# EAGLE schematic clock-generator (EAGLE 7.7.0)
REVISION: v2

## Sheet 1 of 2
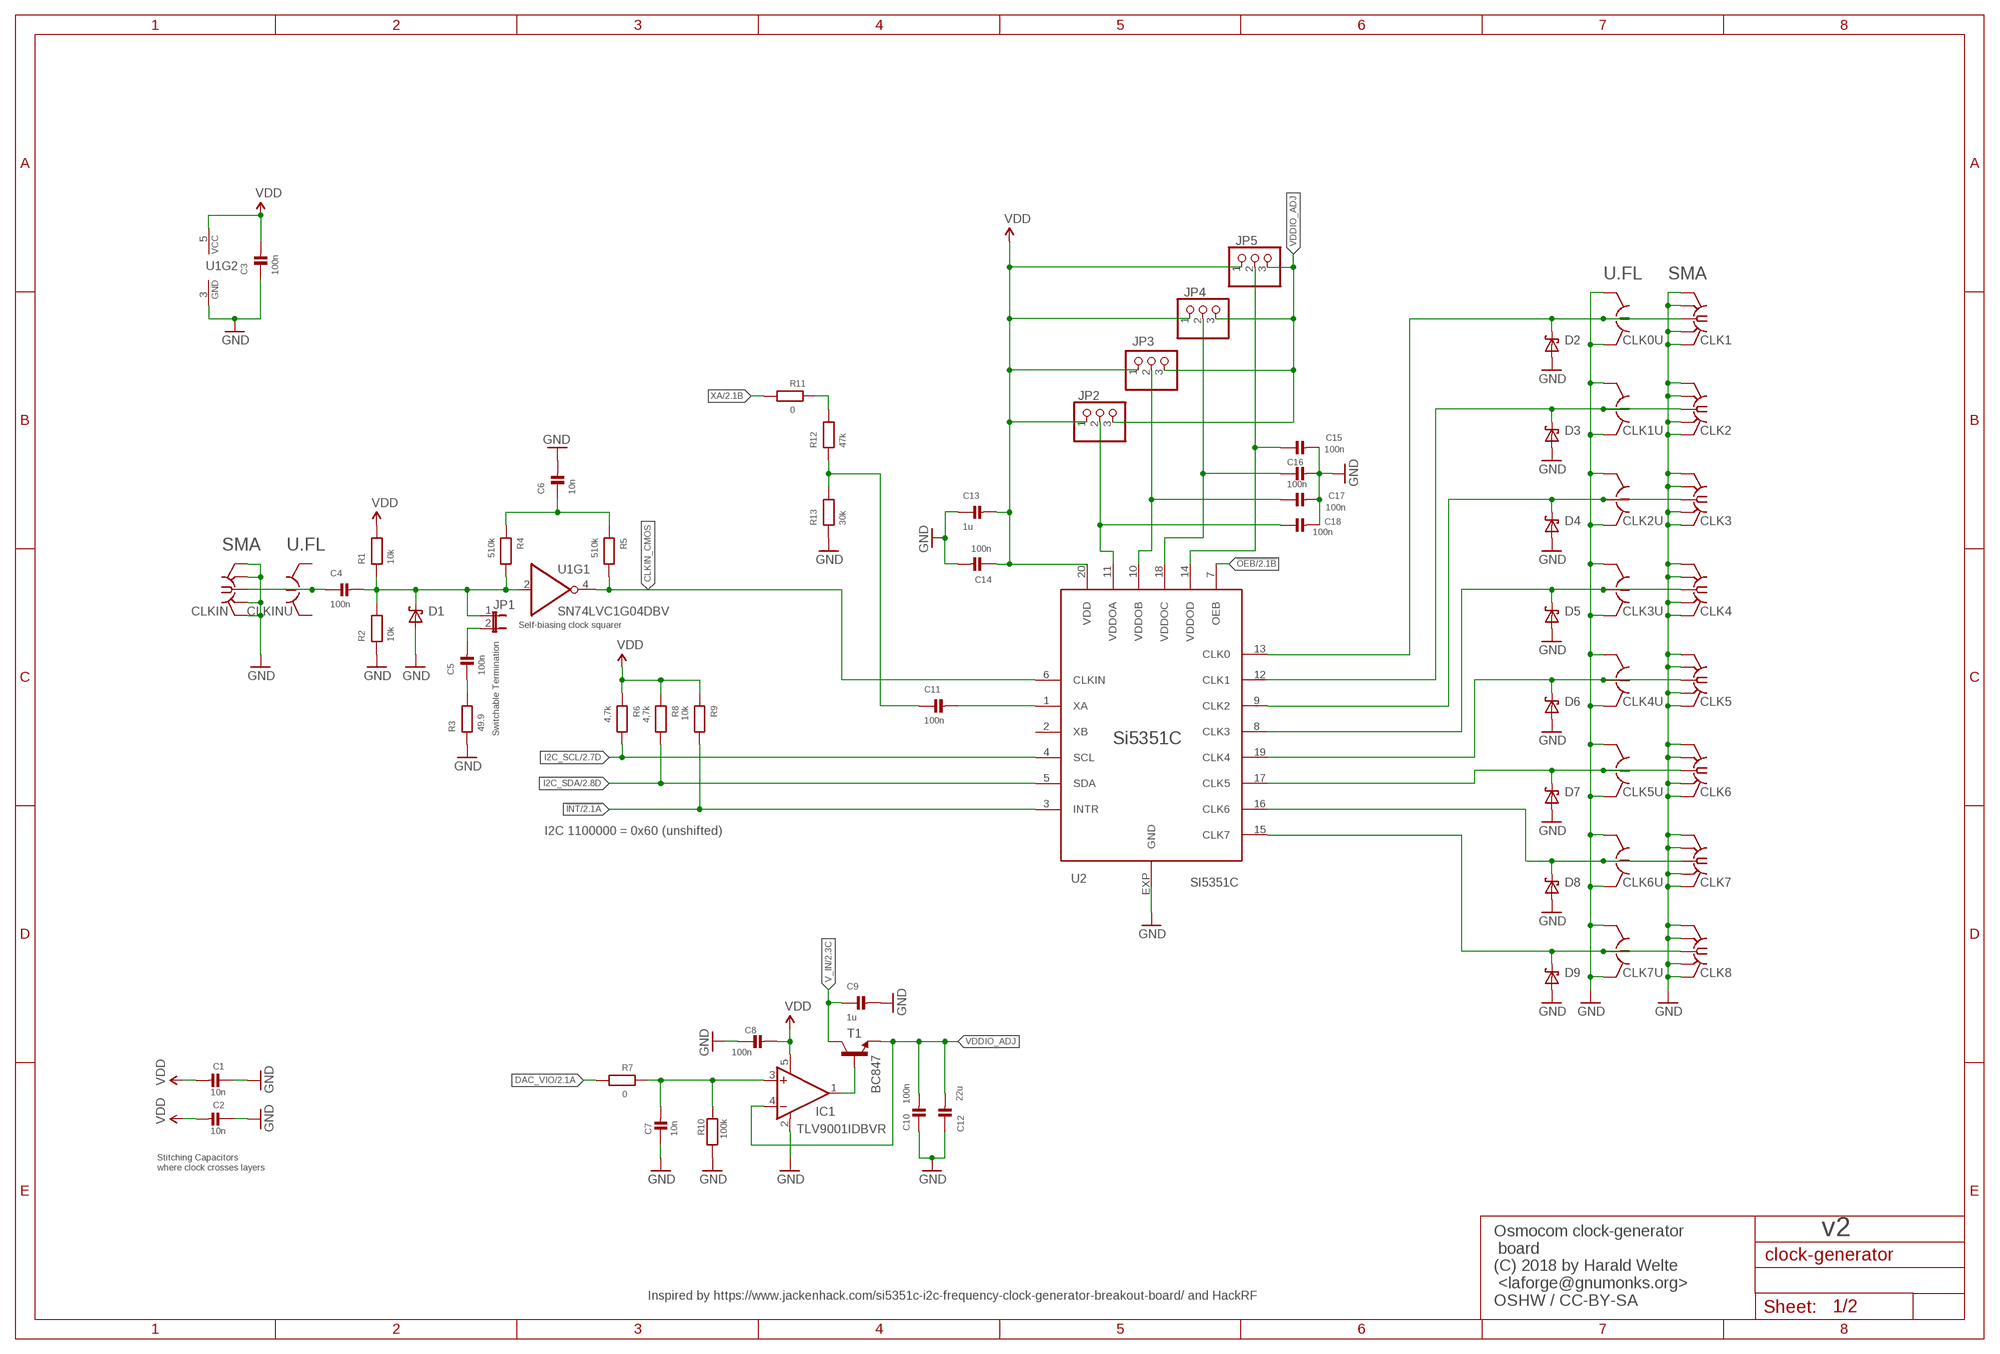
[diagram p0: schematic, sheet 1]

### Parts
C1  10n  CAP_CERAMIC_0402  [_0402]
C2  10n  CAP_CERAMIC_0402  [_0402]
C3  100n  CAP_CERAMIC_0603  [_0603]
C4  100n  CAP_CERAMIC_0603  [_0603]
C5  100n  CAP_CERAMIC_0603  [_0603]
C6  10n  CAP_CERAMIC_0402  [_0402]
C7  10n  CAP_CERAMIC_0402  [_0402]
C8  100n  CAP_CERAMIC_0402  [_0402]
C9  1u  CAP_CERAMIC_0603  [_0603]
C10  100n  CAP_CERAMIC_0402  [_0402]
C11  100n  CAP_CERAMIC_0603  [_0603]
C12  22u  CAP_CERAMIC_0805  [_0805]
C13  1u  CAP_CERAMIC_0603  [_0603]
C14  100n  CAP_CERAMIC_0603  [_0603]
C15  100n  CAP_CERAMIC_0402  [_0402]
C16  100n  CAP_CERAMIC_0402  [_0402]
C17  100n  CAP_CERAMIC_0402  [_0402]
C18  100n  CAP_CERAMIC_0402  [_0402]
CLK0U  HRS_UFL  [HRS_UFL]
CLK1  SMA-F-S-TH  [SMA-F-S-TH]
CLK1U  HRS_UFL  [HRS_UFL]
CLK2  SMA-F-S-TH  [SMA-F-S-TH]
CLK2U  HRS_UFL  [HRS_UFL]
CLK3  SMA-F-S-TH  [SMA-F-S-TH]
CLK3U  HRS_UFL  [HRS_UFL]
CLK4  SMA-F-S-TH  [SMA-F-S-TH]
CLK4U  HRS_UFL  [HRS_UFL]
CLK5  SMA-F-S-TH  [SMA-F-S-TH]
CLK5U  HRS_UFL  [HRS_UFL]
CLK6  SMA-F-S-TH  [SMA-F-S-TH]
CLK6U  HRS_UFL  [HRS_UFL]
CLK7  SMA-F-S-TH  [SMA-F-S-TH]
CLK7U  HRS_UFL  [HRS_UFL]
CLK8  SMA-F-S-TH  [SMA-F-S-TH]
CLKIN  SMA-F-S-TH  [SMA-F-S-TH]
CLKINU  HRS_UFL  [HRS_UFL]
D1  0603ESDA-TR  [0603]
D2  0603ESDA-TR  [0603]
D3  0603ESDA-TR  [0603]
D4  0603ESDA-TR  [0603]
D5  0603ESDA-TR  [0603]
D6  0603ESDA-TR  [0603]
D7  0603ESDA-TR  [0603]
D8  0603ESDA-TR  [0603]
D9  0603ESDA-TR  [0603]
IC1  TLV9001IDBVR  OPA237N  [SOT23-5]
JP1  JP1E  [JP1]
JP2  PINHD-1X03_2.54-S  [1X03-S]
JP3  PINHD-1X03_2.54-S  [1X03-S]
JP4  PINHD-1X03_2.54-S  [1X03-S]
JP5  PINHD-1X03_2.54-S  [1X03-S]
R1  10k  RESISTOR_0603  [_0603]
R2  10k  RESISTOR_0603  [_0603]
R3  49.9  RESISTOR_0603  [_0603]
R4  510k  RESISTOR_0603  [_0603]
R5  510k  RESISTOR_0603  [_0603]
R6  4,7k  RESISTOR_0603  [_0603]
R7  0  RESISTOR_0603  [_0603]
R8  4,7k  RESISTOR_0603  [_0603]
R9  10k  RESISTOR_0603  [_0603]
R10  100k  RESISTOR_0603  [_0603]
R11  0  RESISTOR_0603  [_0603]
R12  47k  RESISTOR_0603  [_0603]
R13  30k  RESISTOR_0603  [_0603]
T1  BC847  BC847C-NPN-SOT23-BEC  [SOT23-BEC]
U1  SN74LVC1G04DBV  [DBV0005A]
U2  SI5351C  [QFN-20]

### Nets
!INT: R9.2 U2.3(INTR) ; also sheet 2
!OEB [supply]: U2.7(OEB) ; also sheet 2
CLK0_LINE [clocklines]: CLK0U.SIG CLK1.C D2.2(K) U2.13(CLK0)
CLK1_LINE [clocklines]: CLK1U.SIG CLK2.C D3.2(K) U2.12(CLK1)
CLK2_LINE [clocklines]: CLK2U.SIG CLK3.C D4.2(K) U2.9(CLK2)
CLK3_LINE [clocklines]: CLK3U.SIG CLK4.C D5.2(K) U2.8(CLK3)
CLK4_LINE [clocklines]: CLK4U.SIG CLK5.C D6.2(K) U2.19(CLK4)
CLK5_LINE [clocklines]: CLK5U.SIG CLK6.C D7.2(K) U2.17(CLK5)
CLK6_LINE [clocklines]: CLK6U.SIG CLK7.C D8.2(K) U2.16(CLK6)
CLK7_LINE [clocklines]: CLK7U.SIG CLK8.C D9.2(K) U2.15(CLK7)
CLKIN [clocklines]: C4.1 CLKIN.C CLKINU.SIG
CLKIN_AC [clocklines]: C4.2 D1.2(K) JP1.1 R1.1 R2.2 R4.2 U1.2(I)
CLKIN_CMOS [clocklines]: R5.2 U1.4(O) U2.6(CLKIN)
DAC_VIO: R7.2 ; also sheet 2
GND [gnd-poly]: C1.1 C2.1 C3.1 C6.2 C7.1 C8.1 C9.2 C10.1 C12.1 C13.1 C14.2 C15.2 C16.2 C17.2 C18.2 CLK0U.GND@1(GND) CLK0U.GND@2(GND) CLK1.G1(GND) CLK1.G2(GND) CLK1.G3(GND) CLK1.G4(GND) CLK1U.GND@1(GND) CLK1U.GND@2(GND) CLK2.G1(GND) CLK2.G2(GND) CLK2.G3(GND) CLK2.G4(GND) CLK2U.GND@1(GND) CLK2U.GND@2(GND) CLK3.G1(GND) CLK3.G2(GND) CLK3.G3(GND) CLK3.G4(GND) CLK3U.GND@1(GND) CLK3U.GND@2(GND) CLK4.G1(GND) CLK4.G2(GND) CLK4.G3(GND) CLK4.G4(GND) CLK4U.GND@1(GND) CLK4U.GND@2(GND) CLK5.G1(GND) CLK5.G2(GND) CLK5.G3(GND) CLK5.G4(GND) CLK5U.GND@1(GND) CLK5U.GND@2(GND) CLK6.G1(GND) CLK6.G2(GND) CLK6.G3(GND) CLK6.G4(GND) CLK6U.GND@1(GND) CLK6U.GND@2(GND) CLK7.G1(GND) CLK7.G2(GND) CLK7.G3(GND) CLK7.G4(GND) CLK7U.GND@1(GND) CLK7U.GND@2(GND) CLK8.G1(GND) CLK8.G2(GND) CLK8.G3(GND) CLK8.G4(GND) CLKIN.G1(GND) CLKIN.G2(GND) CLKIN.G3(GND) CLKIN.G4(GND) D1.1(A) D2.1(A) D3.1(A) D4.1(A) D5.1(A) D6.1(A) D7.1(A) D8.1(A) D9.1(A) IC1.2(V-) R2.1 R3.1 R10.1 R13.2 U1.3(GND) U2.EXP(GND) ; also sheet 2
I2C_SCL: R6.2 U2.4(SCL) ; also sheet 2
I2C_SDA: R8.2 U2.5(SDA) ; also sheet 2
N$2: R11.1 R12.1
N$3: C5.1 R3.2
N$4: C11.1 R12.2 R13.1
N$5: C6.1 R4.1 R5.1
N$7: C5.2 JP1.2
N$8: C11.2 U2.1(XA)
N$21: C7.2 IC1.3(+IN) R7.1 R10.2
N$23 [supply]: IC1.1(OUT) T1.B
V_IN: C9.1 T1.C ; also sheet 2
VDD [supply]: C1.2 C2.2 C3.2 C8.2 C13.2 C14.1 IC1.5(V+) JP2.1 JP3.1 JP4.1 JP5.1 R1.2 R6.1 R8.1 R9.1 U1.5(VCC) U2.20(VDD) ; also sheet 2
VDDIO_ADJ [supply]: C10.2 C12.2 IC1.4(-IN) JP2.3 JP3.3 JP4.3 JP5.3 T1.E
VDDOA [supply]: C18.1 JP2.2 U2.11(VDDOA)
VDDOB [supply]: C17.1 JP3.2 U2.10(VDDOB)
VDDOC [supply]: C16.1 JP4.2 U2.18(VDDOC)
VDDOD [supply]: C15.1 JP5.2 U2.14(VDDOD)
XA: R11.2 ; also sheet 2
Unconnected: U2.2(XB)

### Notes on the sheet
- U.FL | SMA
- SMA | U.FL
- Self-biasing clock squarer
- Switchable Termination
- Si5351C
- I2C 1100000 = 0x60 (unshifted)
- Stitching Capacitors
  where clock crosses layers
- Inspired by https://www.jackenhack.com/si5351c-i2c-frequency-clock-generator-breakout-board/ and HackRF
- Osmocom clock-generator
   board
  (C) 2018 by Harald Welte
   <laforge@gnumonks.org>
  OSHW / CC-BY-SA

## Sheet 2 of 2
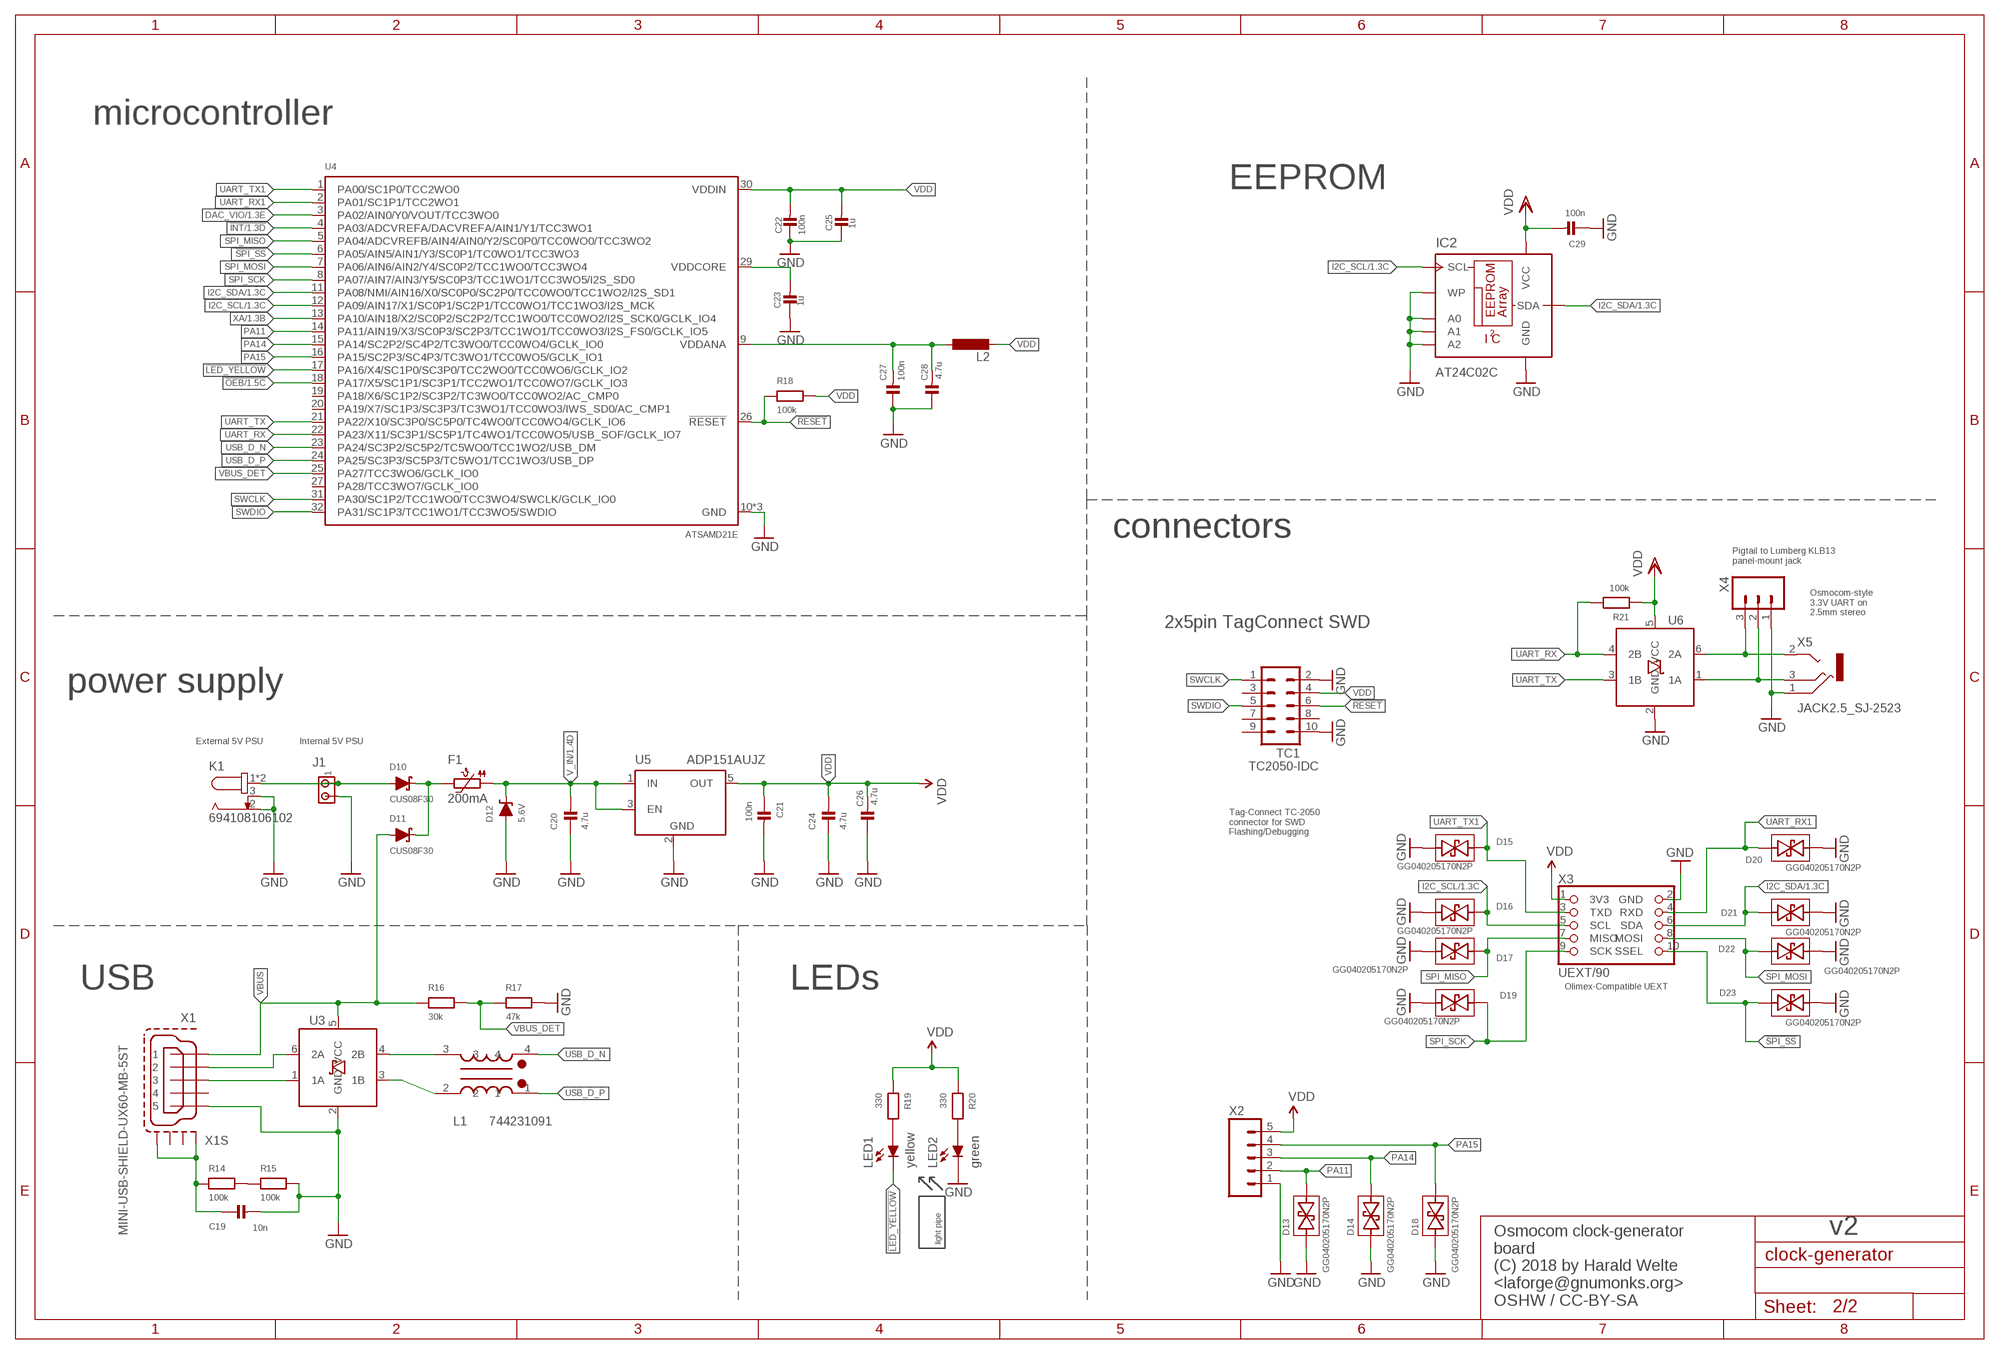
[diagram p1: schematic, sheet 2]

### Parts
C19  10n  CAP_CERAMIC_0402  [_0402]
C20  4.7u  CAP_CERAMIC_0805  [_0805]
C21  100n  CAP_CERAMIC_0603  [_0603]
C22  100n  CAP_CERAMIC_0402  [_0402]
C23  1u  CAP_CERAMIC_0603  [_0603]
C24  4.7u  CAP_CERAMIC_0805  [_0805]
C25  1u  CAP_CERAMIC_0603  [_0603]
C26  4.7u  CAP_CERAMIC_0805  [_0805]
C27  100n  CAP_CERAMIC_0402  [_0402]
C28  4.7u  CAP_CERAMIC_0805  [_0805]
C29  100n  CAP_CERAMIC_0603  [_0603]
D10  CUS08F30  DIODE-SCHOTTKY-SOD-323  [SOD-323]
D11  CUS08F30  DIODE-SCHOTTKY-SOD-323  [SOD-323]
D12  5.6V  DIODDE-ZENER-SMA  [SMADIODE]
D13  GG040205170N2P  TVSDIODE-BIDI-0402  [_0402]
D14  GG040205170N2P  TVSDIODE-BIDI-0402  [_0402]
D15  GG040205170N2P  TVSDIODE-BIDI-0402  [_0402]
D16  GG040205170N2P  TVSDIODE-BIDI-0402  [_0402]
D17  GG040205170N2P  TVSDIODE-BIDI-0402  [_0402]
D18  GG040205170N2P  TVSDIODE-BIDI-0402  [_0402]
D19  GG040205170N2P  TVSDIODE-BIDI-0402  [_0402]
D20  GG040205170N2P  TVSDIODE-BIDI-0402  [_0402]
D21  GG040205170N2P  TVSDIODE-BIDI-0402  [_0402]
D22  GG040205170N2P  TVSDIODE-BIDI-0402  [_0402]
D23  GG040205170N2P  TVSDIODE-BIDI-0402  [_0402]
F1  200mA  POLYFUSE-1206L  [1206L]
IC2  AT24C02C  24C00TS  [TSSOP8]
J1  MTA02-100  [10X02MTA]
K1  694108106102  [694108106102]
L1  744231091  WE-CNSW_0805  [WE-CNSW_0805]
L2  INDUCTOR_0805  [_0805]
LED1  yellow  LEDPLCC2-MIN  [PLCC2-MIN]
LED2  green  LEDPLCC2-MIN  [PLCC2-MIN]
M1  MENTOR_12701001  [1270.1001]
R14  100k  RESISTOR_0603  [_0603]
R15  100k  RESISTOR_0603  [_0603]
R16  30k  RESISTOR_0603  [_0603]
R17  47k  RESISTOR_0603  [_0603]
R18  100k  RESISTOR_0603  [_0603]
R19  330  RESISTOR_0603  [_0603]
R20  330  RESISTOR_0603  [_0603]
R21  100k  RESISTOR_0603  [_0603]
TC1  TC2050-IDC  [TC2050-IDC]
U3  IP4234CZ6  [TSOP-6]
U4  ATSAMD21E  [QFN32_5X5]
U5  ADP151AUJZ  LDO_FIXED_EN-ADP151AUJZ  [SOT23L]
U6  IP4234CZ6  [TSOP-6]
X1  MINI-USB-SHIELD-UX60-MB-5ST  [UX60-MB-5ST]
X2  M05LOCK  [1X05_LOCK]
X3  UEXT/90  [2X05/90]
X4  PINHD-1X3LOCK_NO_SILK  [1X03_LOCK_NO_SILK]
X5  JACK2.5_SJ-2523  [JACK2.5_SJ-2523]

### Nets
!INT: U4.4(PA03/ADCVREFA/DACVREFA/AIN1/Y1/TCC3WO1) ; also sheet 1
!LED_YELLOW: LED1.K(C) U4.17(PA16/X4/SC1P0/SC3P0/TCC2WO0/TCC0WO6/GCLK_IO2)
!OEB [supply]: U4.18(PA17/X5/SC1P1/SC3P1/TCC2WO1/TCC0WO7/GCLK_IO3) ; also sheet 1
!RESET: R18.2 TC1.6 U4.26(!RESET)
!SPI_SS: D23.2 U4.6(PA05/AIN5/AIN1/Y3/SC0P1/TC0WO1/TCC3WO3) X3.10(SSEL)
DAC_VIO: U4.3(PA02/AIN0/Y0/VOUT/TCC3WO0) ; also sheet 1
GND [gnd-poly]: C19.2 C20.1 C21.2 C22.1 C23.1 C24.1 C25.1 C26.1 C27.1 C28.1 C29.1 D12.A D13.1 D14.1 D15.2 D16.2 D17.2 D18.1 D19.1 D20.1 D21.1 D22.1 D23.1 IC2.1(A0) IC2.2(A1) IC2.3(A2) IC2.4(GND) IC2.7(WP) J1.2 K1.2 K1.3 LED2.K(C) R15.1 R17.1 TC1.2 TC1.10 U3.2(GND) U4.10(GND) U4.28(GND) U4.EXP(GND) U5.2(GND) U6.2(GND) X1.5 X2.1 X3.2(GND) X4.1 X5.1(RING) ; also sheet 1
I2C_SCL: D16.1 IC2.6(SCL) U4.12(PA09/AIN17/X1/SC0P1/SC2P1/TCC0WO1/TCC1WO3/I2S_MCK) X3.5(SCL) ; also sheet 1
I2C_SDA: D21.2 IC2.5(SDA) U4.11(PA08/NMI/AIN16/X0/SC0P0/SC2P0/TCC0WO0/TCC1WO2/I2S_SD1) X3.6(SDA) ; also sheet 1
N$1: C23.2 U4.29(VDDCORE)
N$6: D10.C D11.C F1.2
N$11: LED2.A R20.1
N$12: LED1.A R19.1
N$13 [supply]: C27.2 C28.2 L2.1 U4.9(VDDANA)
N$15: D10.A J1.1 K1.1 K1.1-1
N$55: R14.1 R15.2
N$61: C19.1 R14.2 X1.M1(S1) X1.M4(S4)
PA11: D13.2 U4.14(PA11/AIN19/X3/SC0P3/SC2P3/TCC1WO1/TCC0WO3/I2S_FS0/GCLK_IO5) X2.2
PA14: D14.2 U4.15(PA14/SC2P2/SC4P2/TC3WO0/TCC0WO4/GCLK_IO0) X2.3
PA15: D18.2 U4.16(PA15/SC2P3/SC4P3/TC3WO1/TCC0WO5/GCLK_IO1) X2.4
SPI_MISO: D17.1 U4.5(PA04/ADCVREFB/AIN4/AIN0/Y2/SC0P0/TCC0WO0/TCC3WO2) X3.7(MISO)
SPI_MOSI: D22.2 U4.7(PA06/AIN6/AIN2/Y4/SC0P2/TCC1WO0/TCC3WO4) X3.8(MOSI)
SPI_SCK: D19.2 U4.8(PA07/AIN7/AIN3/Y5/SC0P3/TCC1WO1/TCC3WO5/I2S_SD0) X3.9(SCK)
SWCLK: TC1.1 U4.31(PA30/SC1P2/TCC1WO0/TCC3WO4/SWCLK/GCLK_IO0)
SWDIO: TC1.5 U4.32(PA31/SC1P3/TCC1WO1/TCC3WO5/SWDIO)
UART_RX: R21.1 U4.22(PA23/X11/SC3P1/SC5P1/TC4WO1/TCC0WO5/USB_SOF/GCLK_IO7) U6.4(2B)
UART_RX0: U6.6(2A) X4.3 X5.2(TIP)
UART_RX1: D20.2 U4.2(PA01/SC1P1/TCC2WO1) X3.4(RXD)
UART_TX: U4.21(PA22/X10/SC3P0/SC5P0/TC4WO0/TCC0WO4/GCLK_IO6) U6.3(1B)
UART_TX0: U6.1(1A) X4.2 X5.3(MIDDLE)
UART_TX1: D15.1 U4.1(PA00/SC1P0/TCC2WO0) X3.3(TXD)
USB0_D_N [usb]: U3.6(2A) X1.2
USB0_D_P [usb]: U3.1(1A) X1.3
USB1_D_N [usb]: L1.3 U3.4(2B)
USB1_D_P [usb]: L1.2 U3.3(1B)
USB_D_N [usb]: L1.4 U4.23(PA24/SC3P2/SC5P2/TC5WO0/TCC1WO2/USB_DM)
USB_D_P [usb]: L1.1 U4.24(PA25/SC3P3/SC5P3/TC5WO1/TCC1WO3/USB_DP)
V_IN: C20.2 D12.C F1.1 U5.1(IN) U5.3(EN) ; also sheet 1
VBUS [supply]: D11.A R16.2 U3.5(VCC) X1.1
VBUS_DET: R16.1 R17.2 U4.25(PA27/TCC3WO6/GCLK_IO0)
VDD [supply]: C21.1 C22.2 C24.2 C25.2 C26.2 C29.2 IC2.8(VCC) L2.2 R18.1 R19.2 R20.2 R21.2 TC1.4 U4.30(VDDIN) U5.5(OUT) U6.5(VCC) X2.5 X3.1(3V3) ; also sheet 1
XA: U4.13(PA10/AIN18/X2/SC0P2/SC2P2/TCC1WO0/TCC0WO2/I2S_SCK0/GCLK_IO4) ; also sheet 1
Unconnected: TC1.3 TC1.7 TC1.8 TC1.9 U4.19(PA18/X6/SC1P2/SC3P2/TC3WO0/TCC0WO2/AC_CMP0) U4.20(PA19/X7/SC1P3/SC3P3/TC3WO1/TCC0WO3/IWS_SD0/AC_CMP1) U4.27(PA28/TCC3WO7/GCLK_IO0) X1.4 X1.M2(S2) X1.M3(S3)

### Notes on the sheet
- microcontroller
- EEPROM
- connectors
- Pigtail to Lumberg KLB13
  panel-mount jack
- Osmocom-style
  3.3V UART on
  2.5mm stereo
- 2x5pin TagConnect SWD
- power supply
- External 5V PSU | Internal 5V PSU
- Tag-Connect TC-2050
  connector for SWD
  Flashing/Debugging
- USB | LEDs | Olimex-Compatible UEXT
- Osmocom clock-generator 
  board
  (C) 2018 by Harald Welte 
  <laforge@gnumonks.org>
  OSHW / CC-BY-SA

## Power pins joined to a net without a drawn wire
GND: CLKINU.GND@1(GND) CLKINU.GND@2(GND)

## Library data of the parts
C1 C2 C6 C7 C19 = rc-sysmocom:CAP_CERAMIC: Ceramic Capacitors 0402 - 0402 Surface Mount Capacitors 16pF 50V 5% [Digikey: 445-4899-2-ND] 18pF 50V 5% [Digikey: 490-1281-2-ND] 22pF 50V 5% [Digikey: 490-1283-2-ND] 68pF 50V 5% [Digikey: 490-1289-2-ND] 0.1uF 10V 10% [Digikey: 490-1318-2-ND] 1.0uF 6.3V 10% [Digikey: 490-1320-2-ND] 0603 - 0603 Surface Mount Capacitors 16 pF 50V 5% [Digikey: 445-5051-2-ND] 22 pF 50V [Digikey: PCC220ACVTR-ND] 33 pF 50V 5% [Digikey: 490-1415-1-ND] 56pF 50V 5% [Digikey: 490-1421-1-ND] 220pF 50V 5% [Digikey: 445-1285-1-ND] 680 pF 50V 2200 pF 50V 5% C0G [Digikey: 445-1297-1-ND] 5600 pF 100V 5% X7R [Digikey: 478-3711-1-ND] 0.1 µF 25V 10% [Digikey: PCC2277TR-ND] 0.22 µF 16V 10% X7R [Digikey: 445-1318-1-ND] 1.0 µF 25V 10% [Digikey: 445-5146-2-ND] 0603 - RF Specific 3pF 250V +/-0.1pF RF [Digikey: 712-1347-1-ND] 18 pF 250V 5% [Digikey: 478-3505-1-ND or 712-1322-1-ND] 56 pF 250V 5% C0G RF [Digikey: 490-4867-1-ND] 68 pF 250V RF [Digikey: 490-4868-1-ND] 0805 - 0805 Surface Mount Capacitors 220 pF 250V 2% RF Ceramic Capacitor [Digikey: 712-1398-1-ND] 1000 pF 50V 2% NP0 Ceramic Capacitor [Digikey: 478-3760-1-ND] 0.1 µF 25V 10% Ceramic Capacitor [Digikey: PCC1828TR-ND] 1.0 µF 16V 10% Ceramic Capacitor[Digikey: 490-1691-2-ND] 10.0 µF 10V 10% Ceramic Capacitor[Digikey: 709-1228-1-ND] 10.0 uF 16V 10% Ceramic Capacitor [Digikey: 478-5165-2-ND] 47 uF 6.3V 20% Ceramic Capacitor [Digikey: 587-1779-1-ND or 399-5506-1-ND] 1206 - 1206 Surface Mount Capacitors 47uF 10V 20% Ceramic Capacitor [Digikey: 490-5528-1-ND or 399-5508-1-ND or 445-6010-1-ND] 100uF 6.3V -20%, +80% Y5V Ceramic Capacitor (Digikey: 490-4512-1-ND, Mouser: 81-GRM31CF50J107ZE1L) 1810 - 1810 Surface Mount Capacitors High volt MLC; no solder stop between for higher isolation; CLASS: CAPACITOR; DESCRIPTION: CAP CER 10000PF 25V X7R 0402; LINK: https://www.digikey.de/product-detail/de/samsung-electro-mechanics/CL05B103KA5NNNC/1276-1057-1-ND/3889143; MANUFACTURER: Samsung Electro-Mechanics; MANUFACTURERPARTNUMBER: CL05B103KA5NNNC; POPULATED: TRUE; ROHSCERTIFICATE: Bleifrei / RoHS-konform; SOURCE: DIGIKEY; SOURCEPARTNUMBER: 1276-1057-1-ND
C3-C5 C11 C14 C21 C29 = rc-sysmocom:CAP_CERAMIC: Ceramic Capacitors 0402 - 0402 Surface Mount Capacitors 16pF 50V 5% [Digikey: 445-4899-2-ND] 18pF 50V 5% [Digikey: 490-1281-2-ND] 22pF 50V 5% [Digikey: 490-1283-2-ND] 68pF 50V 5% [Digikey: 490-1289-2-ND] 0.1uF 10V 10% [Digikey: 490-1318-2-ND] 1.0uF 6.3V 10% [Digikey: 490-1320-2-ND] 0603 - 0603 Surface Mount Capacitors 16 pF 50V 5% [Digikey: 445-5051-2-ND] 22 pF 50V [Digikey: PCC220ACVTR-ND] 33 pF 50V 5% [Digikey: 490-1415-1-ND] 56pF 50V 5% [Digikey: 490-1421-1-ND] 220pF 50V 5% [Digikey: 445-1285-1-ND] 680 pF 50V 2200 pF 50V 5% C0G [Digikey: 445-1297-1-ND] 5600 pF 100V 5% X7R [Digikey: 478-3711-1-ND] 0.1 µF 25V 10% [Digikey: PCC2277TR-ND] 0.22 µF 16V 10% X7R [Digikey: 445-1318-1-ND] 1.0 µF 25V 10% [Digikey: 445-5146-2-ND] 0603 - RF Specific 3pF 250V +/-0.1pF RF [Digikey: 712-1347-1-ND] 18 pF 250V 5% [Digikey: 478-3505-1-ND or 712-1322-1-ND] 56 pF 250V 5% C0G RF [Digikey: 490-4867-1-ND] 68 pF 250V RF [Digikey: 490-4868-1-ND] 0805 - 0805 Surface Mount Capacitors 220 pF 250V 2% RF Ceramic Capacitor [Digikey: 712-1398-1-ND] 1000 pF 50V 2% NP0 Ceramic Capacitor [Digikey: 478-3760-1-ND] 0.1 µF 25V 10% Ceramic Capacitor [Digikey: PCC1828TR-ND] 1.0 µF 16V 10% Ceramic Capacitor[Digikey: 490-1691-2-ND] 10.0 µF 10V 10% Ceramic Capacitor[Digikey: 709-1228-1-ND] 10.0 uF 16V 10% Ceramic Capacitor [Digikey: 478-5165-2-ND] 47 uF 6.3V 20% Ceramic Capacitor [Digikey: 587-1779-1-ND or 399-5506-1-ND] 1206 - 1206 Surface Mount Capacitors 47uF 10V 20% Ceramic Capacitor [Digikey: 490-5528-1-ND or 399-5508-1-ND or 445-6010-1-ND] 100uF 6.3V -20%, +80% Y5V Ceramic Capacitor (Digikey: 490-4512-1-ND, Mouser: 81-GRM31CF50J107ZE1L) 1810 - 1810 Surface Mount Capacitors High volt MLC; no solder stop between for higher isolation; CLASS: CAPACITOR; DESCRIPTION: CAP CER 0.1UF 16V X7R 0603; LINK: https://www.digikey.de/product-detail/de/samsung-electro-mechanics/CL10B104KO8NNNC/1276-1005-1-ND/3889091; MANUFACTURER: Samsung Electro-Mechanics; MANUFACTURERPARTNUMBER: CL10B104KO8NNNC; POPULATED: TRUE; ROHSCERTIFICATE: Bleifrei / RoHS-konform; SOURCE: DIGIKEY; SOURCEPARTNUMBER: 1276-1005-1-ND
C8 C10 C15-C18 C22 C27 = rc-sysmocom:CAP_CERAMIC: Ceramic Capacitors 0402 - 0402 Surface Mount Capacitors 16pF 50V 5% [Digikey: 445-4899-2-ND] 18pF 50V 5% [Digikey: 490-1281-2-ND] 22pF 50V 5% [Digikey: 490-1283-2-ND] 68pF 50V 5% [Digikey: 490-1289-2-ND] 0.1uF 10V 10% [Digikey: 490-1318-2-ND] 1.0uF 6.3V 10% [Digikey: 490-1320-2-ND] 0603 - 0603 Surface Mount Capacitors 16 pF 50V 5% [Digikey: 445-5051-2-ND] 22 pF 50V [Digikey: PCC220ACVTR-ND] 33 pF 50V 5% [Digikey: 490-1415-1-ND] 56pF 50V 5% [Digikey: 490-1421-1-ND] 220pF 50V 5% [Digikey: 445-1285-1-ND] 680 pF 50V 2200 pF 50V 5% C0G [Digikey: 445-1297-1-ND] 5600 pF 100V 5% X7R [Digikey: 478-3711-1-ND] 0.1 µF 25V 10% [Digikey: PCC2277TR-ND] 0.22 µF 16V 10% X7R [Digikey: 445-1318-1-ND] 1.0 µF 25V 10% [Digikey: 445-5146-2-ND] 0603 - RF Specific 3pF 250V +/-0.1pF RF [Digikey: 712-1347-1-ND] 18 pF 250V 5% [Digikey: 478-3505-1-ND or 712-1322-1-ND] 56 pF 250V 5% C0G RF [Digikey: 490-4867-1-ND] 68 pF 250V RF [Digikey: 490-4868-1-ND] 0805 - 0805 Surface Mount Capacitors 220 pF 250V 2% RF Ceramic Capacitor [Digikey: 712-1398-1-ND] 1000 pF 50V 2% NP0 Ceramic Capacitor [Digikey: 478-3760-1-ND] 0.1 µF 25V 10% Ceramic Capacitor [Digikey: PCC1828TR-ND] 1.0 µF 16V 10% Ceramic Capacitor[Digikey: 490-1691-2-ND] 10.0 µF 10V 10% Ceramic Capacitor[Digikey: 709-1228-1-ND] 10.0 uF 16V 10% Ceramic Capacitor [Digikey: 478-5165-2-ND] 47 uF 6.3V 20% Ceramic Capacitor [Digikey: 587-1779-1-ND or 399-5506-1-ND] 1206 - 1206 Surface Mount Capacitors 47uF 10V 20% Ceramic Capacitor [Digikey: 490-5528-1-ND or 399-5508-1-ND or 445-6010-1-ND] 100uF 6.3V -20%, +80% Y5V Ceramic Capacitor (Digikey: 490-4512-1-ND, Mouser: 81-GRM31CF50J107ZE1L) 1810 - 1810 Surface Mount Capacitors High volt MLC; no solder stop between for higher isolation; CLASS: CAPACITOR; DESCRIPTION: CAP CER 0.1UF 16V X7R 0402; LINK: https://www.digikey.de/product-detail/de/murata-electronics/GCM155R71C104KA55J/490-7998-1-ND; MANUFACTURER: Murata Electronics; MANUFACTURERPARTNUMBER: GCM155R71C104KA55J; POPULATED: TRUE; ROHSCERTIFICATE: UNKNOWN ROHS CERTIFICATE; SOURCE: DIGIKEY; SOURCEPARTNUMBER: 490-7998-1-ND
C9 C13 C23 C25 = rc-sysmocom:CAP_CERAMIC: Ceramic Capacitors 0402 - 0402 Surface Mount Capacitors 16pF 50V 5% [Digikey: 445-4899-2-ND] 18pF 50V 5% [Digikey: 490-1281-2-ND] 22pF 50V 5% [Digikey: 490-1283-2-ND] 68pF 50V 5% [Digikey: 490-1289-2-ND] 0.1uF 10V 10% [Digikey: 490-1318-2-ND] 1.0uF 6.3V 10% [Digikey: 490-1320-2-ND] 0603 - 0603 Surface Mount Capacitors 16 pF 50V 5% [Digikey: 445-5051-2-ND] 22 pF 50V [Digikey: PCC220ACVTR-ND] 33 pF 50V 5% [Digikey: 490-1415-1-ND] 56pF 50V 5% [Digikey: 490-1421-1-ND] 220pF 50V 5% [Digikey: 445-1285-1-ND] 680 pF 50V 2200 pF 50V 5% C0G [Digikey: 445-1297-1-ND] 5600 pF 100V 5% X7R [Digikey: 478-3711-1-ND] 0.1 µF 25V 10% [Digikey: PCC2277TR-ND] 0.22 µF 16V 10% X7R [Digikey: 445-1318-1-ND] 1.0 µF 25V 10% [Digikey: 445-5146-2-ND] 0603 - RF Specific 3pF 250V +/-0.1pF RF [Digikey: 712-1347-1-ND] 18 pF 250V 5% [Digikey: 478-3505-1-ND or 712-1322-1-ND] 56 pF 250V 5% C0G RF [Digikey: 490-4867-1-ND] 68 pF 250V RF [Digikey: 490-4868-1-ND] 0805 - 0805 Surface Mount Capacitors 220 pF 250V 2% RF Ceramic Capacitor [Digikey: 712-1398-1-ND] 1000 pF 50V 2% NP0 Ceramic Capacitor [Digikey: 478-3760-1-ND] 0.1 µF 25V 10% Ceramic Capacitor [Digikey: PCC1828TR-ND] 1.0 µF 16V 10% Ceramic Capacitor[Digikey: 490-1691-2-ND] 10.0 µF 10V 10% Ceramic Capacitor[Digikey: 709-1228-1-ND] 10.0 uF 16V 10% Ceramic Capacitor [Digikey: 478-5165-2-ND] 47 uF 6.3V 20% Ceramic Capacitor [Digikey: 587-1779-1-ND or 399-5506-1-ND] 1206 - 1206 Surface Mount Capacitors 47uF 10V 20% Ceramic Capacitor [Digikey: 490-5528-1-ND or 399-5508-1-ND or 445-6010-1-ND] 100uF 6.3V -20%, +80% Y5V Ceramic Capacitor (Digikey: 490-4512-1-ND, Mouser: 81-GRM31CF50J107ZE1L) 1810 - 1810 Surface Mount Capacitors High volt MLC; no solder stop between for higher isolation; CLASS: CAPACITOR; DESCRIPTION: CAP CER 1UF 10V X5R 0603; LINK: https://www.digikey.de/product-detail/de/samsung-electro-mechanics/CL10A105KP8NNNC/1276-1182-1-ND/3889268; MANUFACTURER: Samsung Electro-Mechanics; MANUFACTURERPARTNUMBER: CL10A105KP8NNNC; POPULATED: TRUE; ROHSCERTIFICATE: Bleifrei / RoHS-konform; SOURCE: DIGIKEY; SOURCEPARTNUMBER: 1276-1182-1-ND
C12 = rc-sysmocom:CAP_CERAMIC: Ceramic Capacitors 0402 - 0402 Surface Mount Capacitors 16pF 50V 5% [Digikey: 445-4899-2-ND] 18pF 50V 5% [Digikey: 490-1281-2-ND] 22pF 50V 5% [Digikey: 490-1283-2-ND] 68pF 50V 5% [Digikey: 490-1289-2-ND] 0.1uF 10V 10% [Digikey: 490-1318-2-ND] 1.0uF 6.3V 10% [Digikey: 490-1320-2-ND] 0603 - 0603 Surface Mount Capacitors 16 pF 50V 5% [Digikey: 445-5051-2-ND] 22 pF 50V [Digikey: PCC220ACVTR-ND] 33 pF 50V 5% [Digikey: 490-1415-1-ND] 56pF 50V 5% [Digikey: 490-1421-1-ND] 220pF 50V 5% [Digikey: 445-1285-1-ND] 680 pF 50V 2200 pF 50V 5% C0G [Digikey: 445-1297-1-ND] 5600 pF 100V 5% X7R [Digikey: 478-3711-1-ND] 0.1 µF 25V 10% [Digikey: PCC2277TR-ND] 0.22 µF 16V 10% X7R [Digikey: 445-1318-1-ND] 1.0 µF 25V 10% [Digikey: 445-5146-2-ND] 0603 - RF Specific 3pF 250V +/-0.1pF RF [Digikey: 712-1347-1-ND] 18 pF 250V 5% [Digikey: 478-3505-1-ND or 712-1322-1-ND] 56 pF 250V 5% C0G RF [Digikey: 490-4867-1-ND] 68 pF 250V RF [Digikey: 490-4868-1-ND] 0805 - 0805 Surface Mount Capacitors 220 pF 250V 2% RF Ceramic Capacitor [Digikey: 712-1398-1-ND] 1000 pF 50V 2% NP0 Ceramic Capacitor [Digikey: 478-3760-1-ND] 0.1 µF 25V 10% Ceramic Capacitor [Digikey: PCC1828TR-ND] 1.0 µF 16V 10% Ceramic Capacitor[Digikey: 490-1691-2-ND] 10.0 µF 10V 10% Ceramic Capacitor[Digikey: 709-1228-1-ND] 10.0 uF 16V 10% Ceramic Capacitor [Digikey: 478-5165-2-ND] 47 uF 6.3V 20% Ceramic Capacitor [Digikey: 587-1779-1-ND or 399-5506-1-ND] 1206 - 1206 Surface Mount Capacitors 47uF 10V 20% Ceramic Capacitor [Digikey: 490-5528-1-ND or 399-5508-1-ND or 445-6010-1-ND] 100uF 6.3V -20%, +80% Y5V Ceramic Capacitor (Digikey: 490-4512-1-ND, Mouser: 81-GRM31CF50J107ZE1L) 1810 - 1810 Surface Mount Capacitors High volt MLC; no solder stop between for higher isolation; CLASS: CAPACITOR; DESCRIPTION: CAP CER 22UF 6.3V 20% X5R 0805; LINK: http://www.digikey.de/product-detail/de/CL21A226MQQNNNE/1276-1100-1-ND; MANUFACTURER: Samsung Electro-Mechanics America, Inc; MANUFACTURERPARTNUMBER: CL21A226MQQNNNE; POPULATED: FALSE; ROHSCERTIFICATE: Bleifrei / RoHS-konform; SOURCE: DIGIKEY; SOURCEPARTNUMBER: 1276-1100-1-ND
C20 C24 C26 C28 = rc-sysmocom:CAP_CERAMIC: Ceramic Capacitors 0402 - 0402 Surface Mount Capacitors 16pF 50V 5% [Digikey: 445-4899-2-ND] 18pF 50V 5% [Digikey: 490-1281-2-ND] 22pF 50V 5% [Digikey: 490-1283-2-ND] 68pF 50V 5% [Digikey: 490-1289-2-ND] 0.1uF 10V 10% [Digikey: 490-1318-2-ND] 1.0uF 6.3V 10% [Digikey: 490-1320-2-ND] 0603 - 0603 Surface Mount Capacitors 16 pF 50V 5% [Digikey: 445-5051-2-ND] 22 pF 50V [Digikey: PCC220ACVTR-ND] 33 pF 50V 5% [Digikey: 490-1415-1-ND] 56pF 50V 5% [Digikey: 490-1421-1-ND] 220pF 50V 5% [Digikey: 445-1285-1-ND] 680 pF 50V 2200 pF 50V 5% C0G [Digikey: 445-1297-1-ND] 5600 pF 100V 5% X7R [Digikey: 478-3711-1-ND] 0.1 µF 25V 10% [Digikey: PCC2277TR-ND] 0.22 µF 16V 10% X7R [Digikey: 445-1318-1-ND] 1.0 µF 25V 10% [Digikey: 445-5146-2-ND] 0603 - RF Specific 3pF 250V +/-0.1pF RF [Digikey: 712-1347-1-ND] 18 pF 250V 5% [Digikey: 478-3505-1-ND or 712-1322-1-ND] 56 pF 250V 5% C0G RF [Digikey: 490-4867-1-ND] 68 pF 250V RF [Digikey: 490-4868-1-ND] 0805 - 0805 Surface Mount Capacitors 220 pF 250V 2% RF Ceramic Capacitor [Digikey: 712-1398-1-ND] 1000 pF 50V 2% NP0 Ceramic Capacitor [Digikey: 478-3760-1-ND] 0.1 µF 25V 10% Ceramic Capacitor [Digikey: PCC1828TR-ND] 1.0 µF 16V 10% Ceramic Capacitor[Digikey: 490-1691-2-ND] 10.0 µF 10V 10% Ceramic Capacitor[Digikey: 709-1228-1-ND] 10.0 uF 16V 10% Ceramic Capacitor [Digikey: 478-5165-2-ND] 47 uF 6.3V 20% Ceramic Capacitor [Digikey: 587-1779-1-ND or 399-5506-1-ND] 1206 - 1206 Surface Mount Capacitors 47uF 10V 20% Ceramic Capacitor [Digikey: 490-5528-1-ND or 399-5508-1-ND or 445-6010-1-ND] 100uF 6.3V -20%, +80% Y5V Ceramic Capacitor (Digikey: 490-4512-1-ND, Mouser: 81-GRM31CF50J107ZE1L) 1810 - 1810 Surface Mount Capacitors High volt MLC; no solder stop between for higher isolation; CLASS: CAPACITOR; DESCRIPTION: CAP CER 4.7UF 16V X5R 0805; LINK: https://www.digikey.de/product-detail/de/samsung-electro-mechanics/CL21A475KOFNNNE/1276-1065-1-ND/3889151; MANUFACTURER: Samsung Electro-Mechanics; MANUFACTURERPARTNUMBER: CL21A475KOFNNNE; POPULATED: TRUE; ROHSCERTIFICATE: Bleifrei / RoHS-konform; SOURCE: DIGIKEY; SOURCEPARTNUMBER: 1276-1065-1-ND
CLK0U CLK1U CLK2U CLK3U CLK4U CLK5U CLK6U CLK7U CLKINU = laforge:HRS_UFL: Hirose U.FL SMT; CLASS: CAPACITOR; DESCRIPTION: CONN U.FL RCPT STR 50 OHM SMD; LINK: https://www.digikey.de/product-detail/de/hirose-electric-co-ltd/U.FL-R-SMT-10/H9161CT-ND/2135256; MANUFACTURER: Hirose Electric Co Ltd; MANUFACTURERPARTNUMBER: U.FL-R-SMT(10); OC_DIGIKEY: H9161CT-ND; POPULATED: TRUE; ROHSCERTIFICATE: Bleifrei / RoHS-konform; SOURCE: DIGIKEY; SOURCEPARTNUMBER: H9161CT-ND
CLK1-CLK8 CLKIN = laforge:SMA-F; CLASS: CAPACITOR; DESCRIPTION: CONN SMA JACK R/A 50 OHM PCB; LINK: https://www.digikey.de/product-detail/de/te-connectivity-amp-connectors/619540-1/A120734-ND/5021655; MANUFACTURER: TE Connectivity AMP Connectors; MANUFACTURERPARTNUMBER: 619540-1; POPULATED: FALSE; ROHSCERTIFICATE: Bleifrei / RoHS-konform; SOURCE: DIGIKEY; SOURCEPARTNUMBER: A120734-ND
D1-D9 = laforge:0603ESDA-TR: Bussmann 0603ESDA-TR ESD Suppressor; CLASS: DIODE; DESCRIPTION: SUPPRESSOR ESD 30VDC 0603 SMD; LINK: https://www.digikey.de/product-detail/de/eaton-electronics-division/0603ESDA2-TR2/283-4156-1-ND/3681415; MANUFACTURER: Eaton - Electronics Division; MANUFACTURERPARTNUMBER: 0603ESDA2-TR2; POPULATED: TRUE; ROHSCERTIFICATE: Bleifrei / RoHS-konform; SOURCE: DIGIKEY; SOURCEPARTNUMBER: 283-4156-1-ND
D10 D11 = diodes-sysmocom:DIODE-SCHOTTKY: Diode SMA Model Volts Amps Type Vf Vr Digikey # Notes SSA34-E3 40V 3A Schottky 480mV @ 3A 200uA @ 40V SSA34-E3/61TGITR-ND CDBA120-G 20V 1A Schottky 500mV @ 1A 500uA @ 20V 641-1014-6-ND REEL MBRA210 10V 2A Schottky 350mV @ 2A 700uA @ 10V MBRA210LT3 SOD-123 Model Volts Amps Type Vf Vr Order # Notes BAT54T1G 30V 200mA Schottky 800mV @ 200mA 2uA @ 25V BAT54T1GOSTR-ND B0530W 30V 500mA Schottky 430mV @ 500mA 130uA @ 30V B0530W-FDICT-ND REEL MBR120 1A 20V Schottky 340mV @ 1A MBR120VLSFT1GOSCT-ND SOD-323 Model Volts Amps Type Vf Vr Order # Notes PMEG2005EJ 20V 500mA Schottky 355mV @ 500mA 568-4110-1-ND ZLLS410 10V 570mA Schottky 380mV @ 570mA ZLLS410CT-ND 1N4148WS 75V 150mA Silicon/Simple 1V 1N4148WSFSCT-ND REEL SOD-523 Model Volts Amps Type Vf Vr Order # Notes BAT54XV2 30V 200mA Schottky 0.8V @ 100mA BAT54XV2CT-ND TB751S 30V 30mA Schottky RB751S-40TE61CT-ND SOT23-R/W (R = Solder Paste/Reflow Ovens, W = Hand-Soldering) Model Volts Amps Type Vf Vr Order # Notes BAT54FILM 40V 300mA Schottky 497-7162-1-ND; CLASS: DIODE; DESCRIPTION: DIODE SCHOTTKY 30V 800MA USC; LINK: https://www.digikey.de/product-detail/de/toshiba-semiconductor-and-storage/CUS08F30H3F/CUS08F30H3FCT-ND/5114376; MANUFACTURER: Toshiba Semiconductor and Storage; MANUFACTURERPARTNUMBER: CUS08F30,H3F; POPULATED: TRUE; ROHSCERTIFICATE: Bleifrei / RoHS-konform; SOURCE: DIGIKEY; SOURCEPARTNUMBER: CUS08F30H3FCT-ND
D12 = diodes-sysmocom:DIODDE-ZENER; CLASS: DIODE; DESCRIPTION: DIODE ZENER 5.6V 3W DO214AC; LINK: https://www.digikey.de/product-detail/de/micro-commercial-co/3SMAJ5919B-TP/3SMAJ5919B-TPMSCT-ND/1793296; MANUFACTURER: Micro Commercial Co; MANUFACTURERPARTNUMBER: 3SMAJ5919B-TP; POPULATED: TRUE; ROHSCERTIFICATE: Bleifrei / RoHS-konform; SOURCE: DIGIKEY; SOURCEPARTNUMBER: 3SMAJ5919B-TPMSCT-ND
D13-D23 = diodes-sysmocom:TVSDIODE-BIDI: TVS diode, bi-directional ESD5V3S1B-02LRH, TPD1E10B06 ...; CLASS: DIODE; DESCRIPTION: TVS DIODE 5V 10V 0402; LINK: https://www.digikey.de/product-detail/de/avx-corporation/GG040205170N2P/478-10595-1-ND/; MANUFACTURER: AVX Corporation; MANUFACTURERPARTNUMBER: GG040205170N2P; POPULATED: TRUE; ROHSCERTIFICATE: Bleifrei / RoHS-konform; SOURCE: DIGIKEY; SOURCEPARTNUMBER: 478-10595-1-ND
F1 = littlefuse:POLYFUSE; CLASS: POLYFUSE; DESCRIPTION: PTC RESET FUSE 30V 200MA 1206; LINK: https://www.digikey.de/product-detail/de/0ZCJ0020FF2E/507-1797-1-ND/4156228/?itemSeq=282618602; MANUFACTURER: Bel Fuse Inc.; MANUFACTURERPARTNUMBER: 0ZCJ0020FF2E; POPULATED: TRUE; ROHSCERTIFICATE: Bleifrei / RoHS-konform; SOURCE: DIGIKEY; SOURCEPARTNUMBER: 507-1797-1-ND
IC1 = burr-brown:OPA237: Operational Amplifiers Single-Supply, MicroAmplifier(TM) Series; CLASS: IC; DESCRIPTION: IC CMOS 1 CIRCUIT SOT23-5; LINK: https://www.digikey.de/product-detail/de/texas-instruments/TLV9001IDBVR/296-TLV9001IDBVRCT-ND; MANUFACTURER: Texas Instruments; MANUFACTURERPARTNUMBER: TLV9001IDBVR; MF: TEXAS INSTRUMENTS; POPULATED: TRUE; ROHSCERTIFICATE: UNKNOWN ROHS CERTIFICATE; SOURCE: DIGIKEY; SOURCEPARTNUMBER: 296-TLV9001IDBVRCT-ND
IC2 = EEPROM-24C0x:24C0*: Serial EEPROM 1 K/2 K, I2C; CLASS: IC; DESCRIPTION: IC EEPROM 2K I2C 1MHZ 8TSSOP; LINK: https://www.digikey.de/product-detail/de/microchip-technology/AT24C02C-XHM-T/AT24C02C-XHM-TCT-ND/3178369; MANUFACTURER: Microchip Technology; MANUFACTURERPARTNUMBER: AT24C02C-XHM-T; POPULATED: TRUE; ROHSCERTIFICATE: Bleifrei / RoHS-konform; SOURCE: DIGIKEY; SOURCEPARTNUMBER: AT24C02C-XHM-TCT-ND
J1 = con-amp:MTA02-100: AMP connector; CLASS: CONNECTOR\JUMPER; DESCRIPTION: NO DESCRIPTION; LINK: UNKNOWN LINK; MANUFACTURER: UNKNOWN MANUFACTURER; MANUFACTURERPARTNUMBER: UNKNOWN MANUFACTURER PART NUMBER; POPULATED: TRUE; ROHSCERTIFICATE: UNKNOWN ROHS CERTIFICATE; SOURCE: UNKNOWN SOURCE; SOURCEPARTNUMBER: UNKNOWN SOURCE PART NUMBER
JP1 = jumper:JP1E: JUMPER; CLASS: CONNECTOR\JUMPER; DESCRIPTION: CONN HEADER VERT 2POS 2.54MM; LINK: https://www.digikey.de/product-detail/de/PREC002SAAN-RC/S1012EC-02-ND/2774852; MANUFACTURER: Sullins Connector Solutions; MANUFACTURERPARTNUMBER: PREC002SAAN-RC; POPULATED: TRUE; ROHSCERTIFICATE: Bleifrei / RoHS-konform; SOURCE: DIGIKEY; SOURCEPARTNUMBER: S1012EC-02-ND
JP2-JP5 = pinhead-2:PINHD-1X03: PIN HEADER; CLASS: CONNECTOR\JUMPER; DESCRIPTION: NO DESCRIPTION; LINK: UNKNOWN LINK; MANUFACTURER: UNKNOWN MANUFACTURER; MANUFACTURERPARTNUMBER: UNKNOWN MANUFACTURER PART NUMBER; POPULATED: TRUE; ROHSCERTIFICATE: UNKNOWN ROHS CERTIFICATE; SOURCE: UNKNOWN SOURCE; SOURCEPARTNUMBER: UNKNOWN SOURCE PART NUMBER
K1 = Wurth_Elektronik_Electromechanic_DC_Power_Jack_Connectors_rev15c:694108106102: WR-DC_DC Power Jack_Right Angled_SMT Center Pin Ø2.5_Plug ID Ø2.55_Plug OD Ø5.5_with 4 Soldering Pad & Peg ;=>Code : Con_WR-DC_SMT_694108106102_694108106102 <http://katalog.we-online.de/media/images/eican/Con_WR-DC_SMT_694108106102_pf2.jpg> Details see: http://katalog.we-online.de/em/datasheet/6941xx106102.pdf Created 2014-10-08, Karrer Zheng 2014 (C) Wurth Elektronik; CLASS: RELAY; DESCRIPTION: CONN PWR JACK 2.5X5.5MM SOLDER; LINK: http://www.digikey.de/product-detail/de/wurth-electronics-inc/694108106102/732-5933-1-ND/5047628; MANUFACTURER: Wurth Electronics Inc.; MANUFACTURERPARTNUMBER: 694108106102; POPULATED: TRUE; ROHSCERTIFICATE: Bleifrei / RoHS-konform; SOURCE: DIGIKEY; SOURCEPARTNUMBER: 732-5933-1-ND
L1 = Wuerth_Elektronik_eiSos_V6_20140807:WE-CNSW: SMD Common Mode Noise Suppressor WE-CNSW - High common mode suppression at high frequency - Small influence for high speed signals through winding symmetry -- USB 2.0 -- Firewire / IEEE 1394 -- Power supply systems -- High Speed Data Lines -- Common mode data line filter <http://katalog.we-online.de/media/images/eisos/IndCNSW_pf2.jpg> Details see: http://katalog.we-online.de/en/pbs/WE-CNSW Updated by Dan Xu 2014-06-30 2014 (C) Würth Elektronik; CLASS: INDUCTOR; DESCRIPTION: CMC 370MA 2LN 90 OHM SMD; LINK: https://www.digikey.de/product-detail/de/wurth-electronics-inc/744231091/732-3198-1-ND; MANUFACTURER: Wurth Electronics Inc.; MANUFACTURERPARTNUMBER: 744231091; POPULATED: TRUE; ROHSCERTIFICATE: Bleifrei / RoHS-konform; SOURCE: DIGIKEY; SOURCEPARTNUMBER: 732-3198-1-ND
L2 = rc-sysmocom:INDUCTOR; CLASS: INDUCTOR; DESCRIPTION: FERRITE BEAD 1 KOHM 0805 1LN; LINK: https://www.digikey.de/product-detail/de/wurth-electronics-inc/742792096/732-4648-1-ND/4310377; MANUFACTURER: Wurth Electronics Inc.; MANUFACTURERPARTNUMBER: 742792096; POPULATED: TRUE; ROHSCERTIFICATE: Bleifrei / RoHS-konform; SOURCE: DIGIKEY; SOURCEPARTNUMBER: 732-4648-1-ND
LED1 = LED-PLCC2:LED: OSRAM types LY T676, LS T670 in P-LLC2 package side-LED types LY A676, LS A676; CLASS: LED; DESCRIPTION: LED YELLOW CLEAR 2PLCC SMD; LINK: https://www.digikey.de/product-detail/de/osram-opto-semiconductors-inc/LY-T676-S1T1-26-Z/475-2665-1-ND; MANUFACTURER: OSRAM Opto Semiconductors Inc.; MANUFACTURERPARTNUMBER: LY T676-S1T1-26-Z; POPULATED: TRUE; ROHSCERTIFICATE: Bleifrei / RoHS-konform; SOURCE: DIGIKEY; SOURCEPARTNUMBER: 475-2665-1-ND
LED2 = LED-PLCC2:LED: OSRAM types LY T676, LS T670 in P-LLC2 package side-LED types LY A676, LS A676; CLASS: LED; DESCRIPTION: LED GREEN CLEAR 2PLCC SMD; LINK: https://www.digikey.de/product-detail/de/osram-opto-semiconductors-inc/LG-T67F-R1T1-24/475-3413-1-ND/7908021; MANUFACTURER: OSRAM Opto Semiconductors Inc.; MANUFACTURERPARTNUMBER: LG T67F-R1T1-24; POPULATED: TRUE; ROHSCERTIFICATE: Bleifrei / RoHS-konform; SOURCE: DIGIKEY; SOURCEPARTNUMBER: 475-3413-1-ND
M1 = Mentor_lightpipe:MENTOR_12701001: MENTOR 1270.1001, PCB Mounted 2-Way Right Angle LED Light Pipe, Bi-Level Clear Round Lens; CLASS: LIGHT GUIDE; DESCRIPTION: NO DESCRIPTION; LINK: UNKNOWN LINK; MANUFACTURER: UNKNOWN MANUFACTURER; MANUFACTURERPARTNUMBER: UNKNOWN MANUFACTURER PART NUMBER; POPULATED: TRUE; ROHSCERTIFICATE: UNKNOWN ROHS CERTIFICATE; SOURCE: UNKNOWN SOURCE; SOURCEPARTNUMBER: UNKNOWN SOURCE PART NUMBER
R1 R2 R9 = rc-sysmocom:RESISTOR: Resistors 0402 - 0402 Surface Mount Package 22 Ohm 1% 1/16W [Digikey: 311-22.0LRTR-ND] 33 Ohm 5% 1/16W 1.0K 5% 1/16W 1.5K 5% 1/16W 2.0K 1% 1/16W 10.0K 1% 1/16W [Digikey: 311-10.0KLRTR-ND] 10.0K 5% 1/16W [Digikey: RMCF0402JT10K0TR-ND] 12.1K 1% 1/16W [Digikey: 311-22.0LRTR-ND] 100.0K 5% 1/16W 0603 - 0603 Surface Mount Package 1/10 Watt 0805 - 0805 Surface Mount Package 1/8 Watt 1206 - 1206 Surface Mount Package 2012 - 2010 Surface Mount Package 0.11 Ohm 1/2 Watt 1% Resistor - Digikey: RHM.11UCT-ND; CLASS: RESISTOR; DESCRIPTION: RES 10K OHM 5%% 1/10W 0603; LINK: https://www.digikey.de/product-detail/de/stackpole-electronics-inc/RMCF0603JT10K0/RMCF0603JT10K0CT-ND/1943191; MANUFACTURER: Stackpole Electronics Inc.; MANUFACTURERPARTNUMBER: RMCF0603JT10K0; POPULATED: TRUE; ROHSCERTIFICATE: Bleifrei / RoHS-konform; SOURCE: DIGIKEY; SOURCEPARTNUMBER: RMCF0603JT10K0CT-ND
R3 = rc-sysmocom:RESISTOR: Resistors 0402 - 0402 Surface Mount Package 22 Ohm 1% 1/16W [Digikey: 311-22.0LRTR-ND] 33 Ohm 5% 1/16W 1.0K 5% 1/16W 1.5K 5% 1/16W 2.0K 1% 1/16W 10.0K 1% 1/16W [Digikey: 311-10.0KLRTR-ND] 10.0K 5% 1/16W [Digikey: RMCF0402JT10K0TR-ND] 12.1K 1% 1/16W [Digikey: 311-22.0LRTR-ND] 100.0K 5% 1/16W 0603 - 0603 Surface Mount Package 1/10 Watt 0805 - 0805 Surface Mount Package 1/8 Watt 1206 - 1206 Surface Mount Package 2012 - 2010 Surface Mount Package 0.11 Ohm 1/2 Watt 1% Resistor - Digikey: RHM.11UCT-ND; CLASS: RESISTOR; DESCRIPTION: RES 49.9 OHM 1%% 1/10W 0603; LINK: https://www.digikey.de/product-detail/de/stackpole-electronics-inc/RMCF0603FT49R9/RMCF0603FT49R9CT-ND/1942956; MANUFACTURER: Stackpole Electronics Inc.; MANUFACTURERPARTNUMBER: RMCF0603FT49R9; POPULATED: TRUE; ROHSCERTIFICATE: Bleifrei / RoHS-konform; SOURCE: DIGIKEY; SOURCEPARTNUMBER: RMCF0603FT49R9CT-ND
R4 R5 = rc-sysmocom:RESISTOR: Resistors 0402 - 0402 Surface Mount Package 22 Ohm 1% 1/16W [Digikey: 311-22.0LRTR-ND] 33 Ohm 5% 1/16W 1.0K 5% 1/16W 1.5K 5% 1/16W 2.0K 1% 1/16W 10.0K 1% 1/16W [Digikey: 311-10.0KLRTR-ND] 10.0K 5% 1/16W [Digikey: RMCF0402JT10K0TR-ND] 12.1K 1% 1/16W [Digikey: 311-22.0LRTR-ND] 100.0K 5% 1/16W 0603 - 0603 Surface Mount Package 1/10 Watt 0805 - 0805 Surface Mount Package 1/8 Watt 1206 - 1206 Surface Mount Package 2012 - 2010 Surface Mount Package 0.11 Ohm 1/2 Watt 1% Resistor - Digikey: RHM.11UCT-ND; CLASS: RESISTOR; DESCRIPTION: RES SMD 510K OHM 1%% 1/10W 0603; LINK: https://www.digikey.de/product-detail/de/yageo/RC0603FR-07510KL/311-510KHRCT-ND/730233; MANUFACTURER: Yageo; MANUFACTURERPARTNUMBER: RC0603FR-07510KL; POPULATED: TRUE; ROHSCERTIFICATE: Bleifrei / RoHS-konform; SOURCE: DIGIKEY; SOURCEPARTNUMBER: 311-510KHRCT-ND
R6 R8 = rc-sysmocom:RESISTOR: Resistors 0402 - 0402 Surface Mount Package 22 Ohm 1% 1/16W [Digikey: 311-22.0LRTR-ND] 33 Ohm 5% 1/16W 1.0K 5% 1/16W 1.5K 5% 1/16W 2.0K 1% 1/16W 10.0K 1% 1/16W [Digikey: 311-10.0KLRTR-ND] 10.0K 5% 1/16W [Digikey: RMCF0402JT10K0TR-ND] 12.1K 1% 1/16W [Digikey: 311-22.0LRTR-ND] 100.0K 5% 1/16W 0603 - 0603 Surface Mount Package 1/10 Watt 0805 - 0805 Surface Mount Package 1/8 Watt 1206 - 1206 Surface Mount Package 2012 - 2010 Surface Mount Package 0.11 Ohm 1/2 Watt 1% Resistor - Digikey: RHM.11UCT-ND; CLASS: RESISTOR; DESCRIPTION: RES SMD 4.7K OHM 5% 1/10W 0603; LINK: http://www.digikey.de/product-detail/de/RC0603JR-074K7L/311-4.7KGRCT-ND/729732; MANUFACTURER: Yageo; MANUFACTURERPARTNUMBER: RC0603JR-074K7L; POPULATED: TRUE; ROHSCERTIFICATE: Bleifrei / RoHS-konform; SOURCE: DIGIKEY; SOURCEPARTNUMBER: 311-4.7KGRCT-ND
R7 R11 = rc-sysmocom:RESISTOR: Resistors 0402 - 0402 Surface Mount Package 22 Ohm 1% 1/16W [Digikey: 311-22.0LRTR-ND] 33 Ohm 5% 1/16W 1.0K 5% 1/16W 1.5K 5% 1/16W 2.0K 1% 1/16W 10.0K 1% 1/16W [Digikey: 311-10.0KLRTR-ND] 10.0K 5% 1/16W [Digikey: RMCF0402JT10K0TR-ND] 12.1K 1% 1/16W [Digikey: 311-22.0LRTR-ND] 100.0K 5% 1/16W 0603 - 0603 Surface Mount Package 1/10 Watt 0805 - 0805 Surface Mount Package 1/8 Watt 1206 - 1206 Surface Mount Package 2012 - 2010 Surface Mount Package 0.11 Ohm 1/2 Watt 1% Resistor - Digikey: RHM.11UCT-ND; CLASS: RESISTOR; DESCRIPTION: RES 0.0 OHM 1/10W JUMP 0603; LINK: http://www.digikey.de/product-detail/de/foo/1276-3510-1-ND; MANUFACTURER: Samsung Electro-Mechanics America, Inc; MANUFACTURERPARTNUMBER: RC1608J000CS; POPULATED: TRUE; ROHSCERTIFICATE: Bleifrei / RoHS-konform; SOURCE: DIGIKEY; SOURCEPARTNUMBER: 1276-3510-1-ND
R10 R14 R15 R18 R21 = rc-sysmocom:RESISTOR: Resistors 0402 - 0402 Surface Mount Package 22 Ohm 1% 1/16W [Digikey: 311-22.0LRTR-ND] 33 Ohm 5% 1/16W 1.0K 5% 1/16W 1.5K 5% 1/16W 2.0K 1% 1/16W 10.0K 1% 1/16W [Digikey: 311-10.0KLRTR-ND] 10.0K 5% 1/16W [Digikey: RMCF0402JT10K0TR-ND] 12.1K 1% 1/16W [Digikey: 311-22.0LRTR-ND] 100.0K 5% 1/16W 0603 - 0603 Surface Mount Package 1/10 Watt 0805 - 0805 Surface Mount Package 1/8 Watt 1206 - 1206 Surface Mount Package 2012 - 2010 Surface Mount Package 0.11 Ohm 1/2 Watt 1% Resistor - Digikey: RHM.11UCT-ND; CLASS: RESISTOR; DESCRIPTION: RES SMD 100K OHM 5%% 1/10W 0603; LINK: https://www.digikey.de/product-detail/de/yageo/RC0603JR-07100KL/311-100KGRCT-ND/729645; MANUFACTURER: Yageo; MANUFACTURERPARTNUMBER: RC0603JR-07100KL; POPULATED: TRUE; ROHSCERTIFICATE: Bleifrei / RoHS-konform; SOURCE: DIGIKEY; SOURCEPARTNUMBER: 311-100KGRCT-ND
R12 R17 = rc-sysmocom:RESISTOR: Resistors 0402 - 0402 Surface Mount Package 22 Ohm 1% 1/16W [Digikey: 311-22.0LRTR-ND] 33 Ohm 5% 1/16W 1.0K 5% 1/16W 1.5K 5% 1/16W 2.0K 1% 1/16W 10.0K 1% 1/16W [Digikey: 311-10.0KLRTR-ND] 10.0K 5% 1/16W [Digikey: RMCF0402JT10K0TR-ND] 12.1K 1% 1/16W [Digikey: 311-22.0LRTR-ND] 100.0K 5% 1/16W 0603 - 0603 Surface Mount Package 1/10 Watt 0805 - 0805 Surface Mount Package 1/8 Watt 1206 - 1206 Surface Mount Package 2012 - 2010 Surface Mount Package 0.11 Ohm 1/2 Watt 1% Resistor - Digikey: RHM.11UCT-ND; CLASS: RESISTOR; DESCRIPTION: RES SMD 47K OHM 5%% 1/10W 0603; LINK: https://www.digikey.de/product-detail/de/yageo/RC0603JR-0747KL/311-47KGRCT-ND/729741; MANUFACTURER: Yageo; MANUFACTURERPARTNUMBER: RC0603JR-0747KL; POPULATED: TRUE; ROHSCERTIFICATE: Bleifrei / RoHS-konform; SOURCE: DIGIKEY; SOURCEPARTNUMBER: 311-47KGRCT-ND
R13 R16 = rc-sysmocom:RESISTOR: Resistors 0402 - 0402 Surface Mount Package 22 Ohm 1% 1/16W [Digikey: 311-22.0LRTR-ND] 33 Ohm 5% 1/16W 1.0K 5% 1/16W 1.5K 5% 1/16W 2.0K 1% 1/16W 10.0K 1% 1/16W [Digikey: 311-10.0KLRTR-ND] 10.0K 5% 1/16W [Digikey: RMCF0402JT10K0TR-ND] 12.1K 1% 1/16W [Digikey: 311-22.0LRTR-ND] 100.0K 5% 1/16W 0603 - 0603 Surface Mount Package 1/10 Watt 0805 - 0805 Surface Mount Package 1/8 Watt 1206 - 1206 Surface Mount Package 2012 - 2010 Surface Mount Package 0.11 Ohm 1/2 Watt 1% Resistor - Digikey: RHM.11UCT-ND; CLASS: RESISTOR; DESCRIPTION: RES SMD 30K OHM 5%% 1/10W 0603; LINK: https://www.digikey.de/product-detail/de/yageo/RC0603JR-0730KL/311-30KGRCT-ND/729715; MANUFACTURER: Yageo; MANUFACTURERPARTNUMBER: RC0603JR-0730KL; POPULATED: TRUE; ROHSCERTIFICATE: Bleifrei / RoHS-konform; SOURCE: DIGIKEY; SOURCEPARTNUMBER: 311-30KGRCT-ND
R19 R20 = rc-sysmocom:RESISTOR: Resistors 0402 - 0402 Surface Mount Package 22 Ohm 1% 1/16W [Digikey: 311-22.0LRTR-ND] 33 Ohm 5% 1/16W 1.0K 5% 1/16W 1.5K 5% 1/16W 2.0K 1% 1/16W 10.0K 1% 1/16W [Digikey: 311-10.0KLRTR-ND] 10.0K 5% 1/16W [Digikey: RMCF0402JT10K0TR-ND] 12.1K 1% 1/16W [Digikey: 311-22.0LRTR-ND] 100.0K 5% 1/16W 0603 - 0603 Surface Mount Package 1/10 Watt 0805 - 0805 Surface Mount Package 1/8 Watt 1206 - 1206 Surface Mount Package 2012 - 2010 Surface Mount Package 0.11 Ohm 1/2 Watt 1% Resistor - Digikey: RHM.11UCT-ND; CLASS: RESISTOR; DESCRIPTION: RES 330 OHM 5%% 1/10W 0603; LINK: https://www.digikey.de/product-detail/de/stackpole-electronics-inc/RMCF0603JT330R/RMCF0603JT330RCT-ND/1943164; MANUFACTURER: Stackpole Electronics Inc.; MANUFACTURERPARTNUMBER: RMCF0603JT330R; POPULATED: TRUE; ROHSCERTIFICATE: Bleifrei / RoHS-konform; SOURCE: DIGIKEY; SOURCEPARTNUMBER: RMCF0603JT330RCT-ND
T1 = transistor:*-NPN-: NPN Transistror BF959 corrected 2008.03.06; CLASS: TRANSISTOR; DESCRIPTION: TRANS NPN 45V 0.1A SOT23; LINK: https://www.digikey.de/product-detail/de/nexperia-usa-inc/BC847C,215/1727-2924-1-ND; MANUFACTURER: Nexperia USA Inc.; MANUFACTURERPARTNUMBER: BC847C,215; POPULATED: TRUE; ROHSCERTIFICATE: Bleifrei / RoHS-konform; SOURCE: DIGIKEY; SOURCEPARTNUMBER: 1727-2924-1-ND
TC1 = tag-connect:TC2050-IDC: Tag-Connect In Circuit Programming & Debug Cable 10 Pin http://www.tag-connect.com; CLASS: FOOTPRINT; DESCRIPTION: TAG-CONNECT footprint; LINK: UNKNOWN LINK; MANUFACTURER: TAG-CONNECT; MANUFACTURERPARTNUMBER: TC-2050; POPULATED: FALSE; ROHSCERTIFICATE: UNKNOWN ROHS CERTIFICATE; SOURCE: UNKNOWN SOURCE; SOURCEPARTNUMBER: UNKNOWN SOURCE PART NUMBER
U1 = sn74lvc2g04:SN74LVC1G04: SN74LVC1G04 Single Inverter Gate; CLASS: IC; DESCRIPTION: IC INVERTER 1CH 1-INP SOT23-5; LINK: https://www.digikey.de/product-detail/de/texas-instruments/SN74LVC1G04DBVR/296-11599-1-ND/385738; MANUFACTURER: Texas Instruments; MANUFACTURERPARTNUMBER: SN74LVC1G04DBVR; POPULATED: TRUE; ROHSCERTIFICATE: Bleifrei / RoHS-konform; SOURCE: DIGIKEY; SOURCEPARTNUMBER: 296-11599-1-ND
U2 = jackens:SI5351C: The Si5351 is an I2C configurable clock generator that is ideally suited for replacing crystals, crystal oscillators, VCXOs, phase-locked loops PLLs, and fanout buffers in cost-sensitive applications.; CLASS: IC; DESCRIPTION: IC CLK GENERATOR 200MHZ 20QFN; LINK: https://www.digikey.de/product-detail/de/silicon-labs/SI5351C-B-GMR/336-5160-6-ND/9175854; MANUFACTURER: Silicon Labs; MANUFACTURERPARTNUMBER: SI5351C-B-GMR; POPULATED: TRUE; ROHSCERTIFICATE: Bleifrei / RoHS-konform; SOURCE: DIGIKEY; SOURCEPARTNUMBER: 336-5160-6-ND
U3 U6 = laforge:IP4234CZ6: NXP IP4234CZ6 - Single USB 2.0 ESD protection to IEC 61000-4-2 level 4; CLASS: IC; DESCRIPTION: TVS DIODE 5.5V 6TSOP; LINK: https://www.digikey.de/product-detail/de/nexperia-usa-inc/IP4234CZ6125/1727-4717-1-ND/2531156; MANUFACTURER: Nexperia USA Inc.; MANUFACTURERPARTNUMBER: IP4234CZ6,125; OC_DIGIKEY: 568-5869-1-ND; POPULATED: TRUE; ROHSCERTIFICATE: Bleifrei / RoHS-konform; SOURCE: DIGIKEY; SOURCEPARTNUMBER: 1727-4717-1-ND
U4 = atmel-arm:ATSAMD21E: Atmel/Microchip SAMD21ExA/B/C/D in QFN32 package; CLASS: IC; DESCRIPTION: IC MCU 32BIT 256KB FLASH 32QFN; LINK: https://www.digikey.de/product-detail/de/microchip-technology/ATSAMD21E18A-MUT/ATSAMD21E18A-MUTCT-ND; MANUFACTURER: Microchip Technology; MANUFACTURERPARTNUMBER: ATSAMD21E18A-MUT; POPULATED: TRUE; ROHSCERTIFICATE: RoHS3-konform; SOURCE: DIGIKEY; SOURCEPARTNUMBER: ATSAMD21E18A-MUTCT-ND
U5 = ldo:LDO_FIXED_EN: High-Performance Single 150mA LDO; CLASS: IC; DESCRIPTION: IC REG LINEAR 3V 200MA TSOT5; LINK: https://www.digikey.de/product-detail/de/analog-devices-inc/ADP151AUJZ-3.0-R7/ADP151AUJZ-3.0-R7CT-ND/2334207; MANUFACTURER: Analog Devices Inc.; MANUFACTURERPARTNUMBER: ADP151AUJZ-3.0-R7; POPULATED: TRUE; ROHSCERTIFICATE: Bleifrei / RoHS-konform; SOURCE: DIGIKEY; SOURCEPARTNUMBER: ADP151AUJZ-3.0-R7CT-ND
X1 = con-hirose:MINI-USB-SHIELD-: MINI USB Connector Source: http://www.hirose.co.jp/cataloge_hp/e24000019.pdf; CLASS: CONNECTOR; DESCRIPTION: CONN RCPT USB2.0 MINI B SMD R/A; LINK: https://www.digikey.de/product-detail/de/hirose-electric-co-ltd/UX60A-MB-5ST/H2961CT-ND/597540; MANUFACTURER: Hirose Electric Co Ltd; MANUFACTURERPARTNUMBER: UX60A-MB-5ST; OC_FARNELL: unknown; OC_NEWARK: unknown; POPULATED: TRUE; ROHSCERTIFICATE: Bleifrei / RoHS-konform; SOURCE: DIGIKEY; SOURCEPARTNUMBER: H2961CT-ND
X2 = SparkFun-Connectors:M05: Header 5 Standard 5-pin 0.1" header. Use with straight break away headers (SKU : PRT-00116), right angle break away headers (PRT-00553), swiss pins (PRT-00743), machine pins (PRT-00117), and female headers (PRT-00115). Molex polarized connector foot print use with SKU : PRT-08230 with associated crimp pins and housings.; CLASS: CONNECTOR; DESCRIPTION: NO DESCRIPTION; LINK: UNKNOWN LINK; MANUFACTURER: UNKNOWN MANUFACTURER; MANUFACTURERPARTNUMBER: UNKNOWN MANUFACTURER PART NUMBER; POPULATED: TRUE; ROHSCERTIFICATE: UNKNOWN ROHS CERTIFICATE; SOURCE: UNKNOWN SOURCE; SOURCEPARTNUMBER: UNKNOWN SOURCE PART NUMBER
X3 = laforge:UEXT: UEXT header as used by lots of Olimex designs; CLASS: CONNECTOR; DESCRIPTION: CONN HEADER VERT 10POS 2.54MM; LINK: https://www.digikey.de/product-detail/de/on-shore-technology-inc/302-S101/ED1543-ND/2178422; MANUFACTURER: On Shore Technology Inc.; MANUFACTURERPARTNUMBER: 302-S101; POPULATED: TRUE; ROHSCERTIFICATE: Bleifrei / RoHS-konform; SOURCE: DIGIKEY; SOURCEPARTNUMBER: ED1543-ND
X4 = laforge:PINHD-1X3: Header 3 Standard 3-pin 0.1" header; CLASS: CONNECTOR; DESCRIPTION: NO DESCRIPTION; LINK: UNKNOWN LINK; MANUFACTURER: UNKNOWN MANUFACTURER; MANUFACTURERPARTNUMBER: UNKNOWN MANUFACTURER PART NUMBER; POPULATED: FALSE; ROHSCERTIFICATE: UNKNOWN ROHS CERTIFICATE; SOURCE: UNKNOWN SOURCE; SOURCEPARTNUMBER: UNKNOWN SOURCE PART NUMBER
X5 = laforge:JACK2.5_SJ-2523: CUI Inc. SJ-2523-SMT; CLASS: CONNECTOR; DESCRIPTION: CONN JACK STEREO 2.5MM SMD R/A; LINK: https://www.digikey.de/product-detail/de/cui-inc/SJ-2523-SMT-TR/CP-2523SJCT-ND/669702; MANUFACTURER: CUI Inc.; MANUFACTURERPARTNUMBER: SJ-2523-SMT-TR; OC_DIGIKEY: CP-2523SJCT-ND; POPULATED: TRUE; ROHSCERTIFICATE: Bleifrei / RoHS-konform; SOURCE: DIGIKEY; SOURCEPARTNUMBER: CP-2523SJCT-ND

## Net classes
1 clocklines: width 1.1 mm, clearance 0.2 mm to class 0, clearance 0.2 mm
3 usb: width 0.6 mm, drill 0.2 mm, clearance 0.2 mm to class 0, clearance 0.2 mm to class 1, clearance 0.2 mm to class 2, clearance 0.2 mm
4 gnd-poly: width 0.4 mm, drill 0.2 mm, clearance 0.3 mm to class 0, clearance 0.18 mm to class 1, clearance 0.2 mm to class 2, clearance 0.2 mm to class 3, clearance 0.2 mm